# Altium schematic sheet printer_control.SchDoc
size A2; DocumentNumber: 8; Revision: V1.0; SheetNumber: 8; SheetTotal: 9
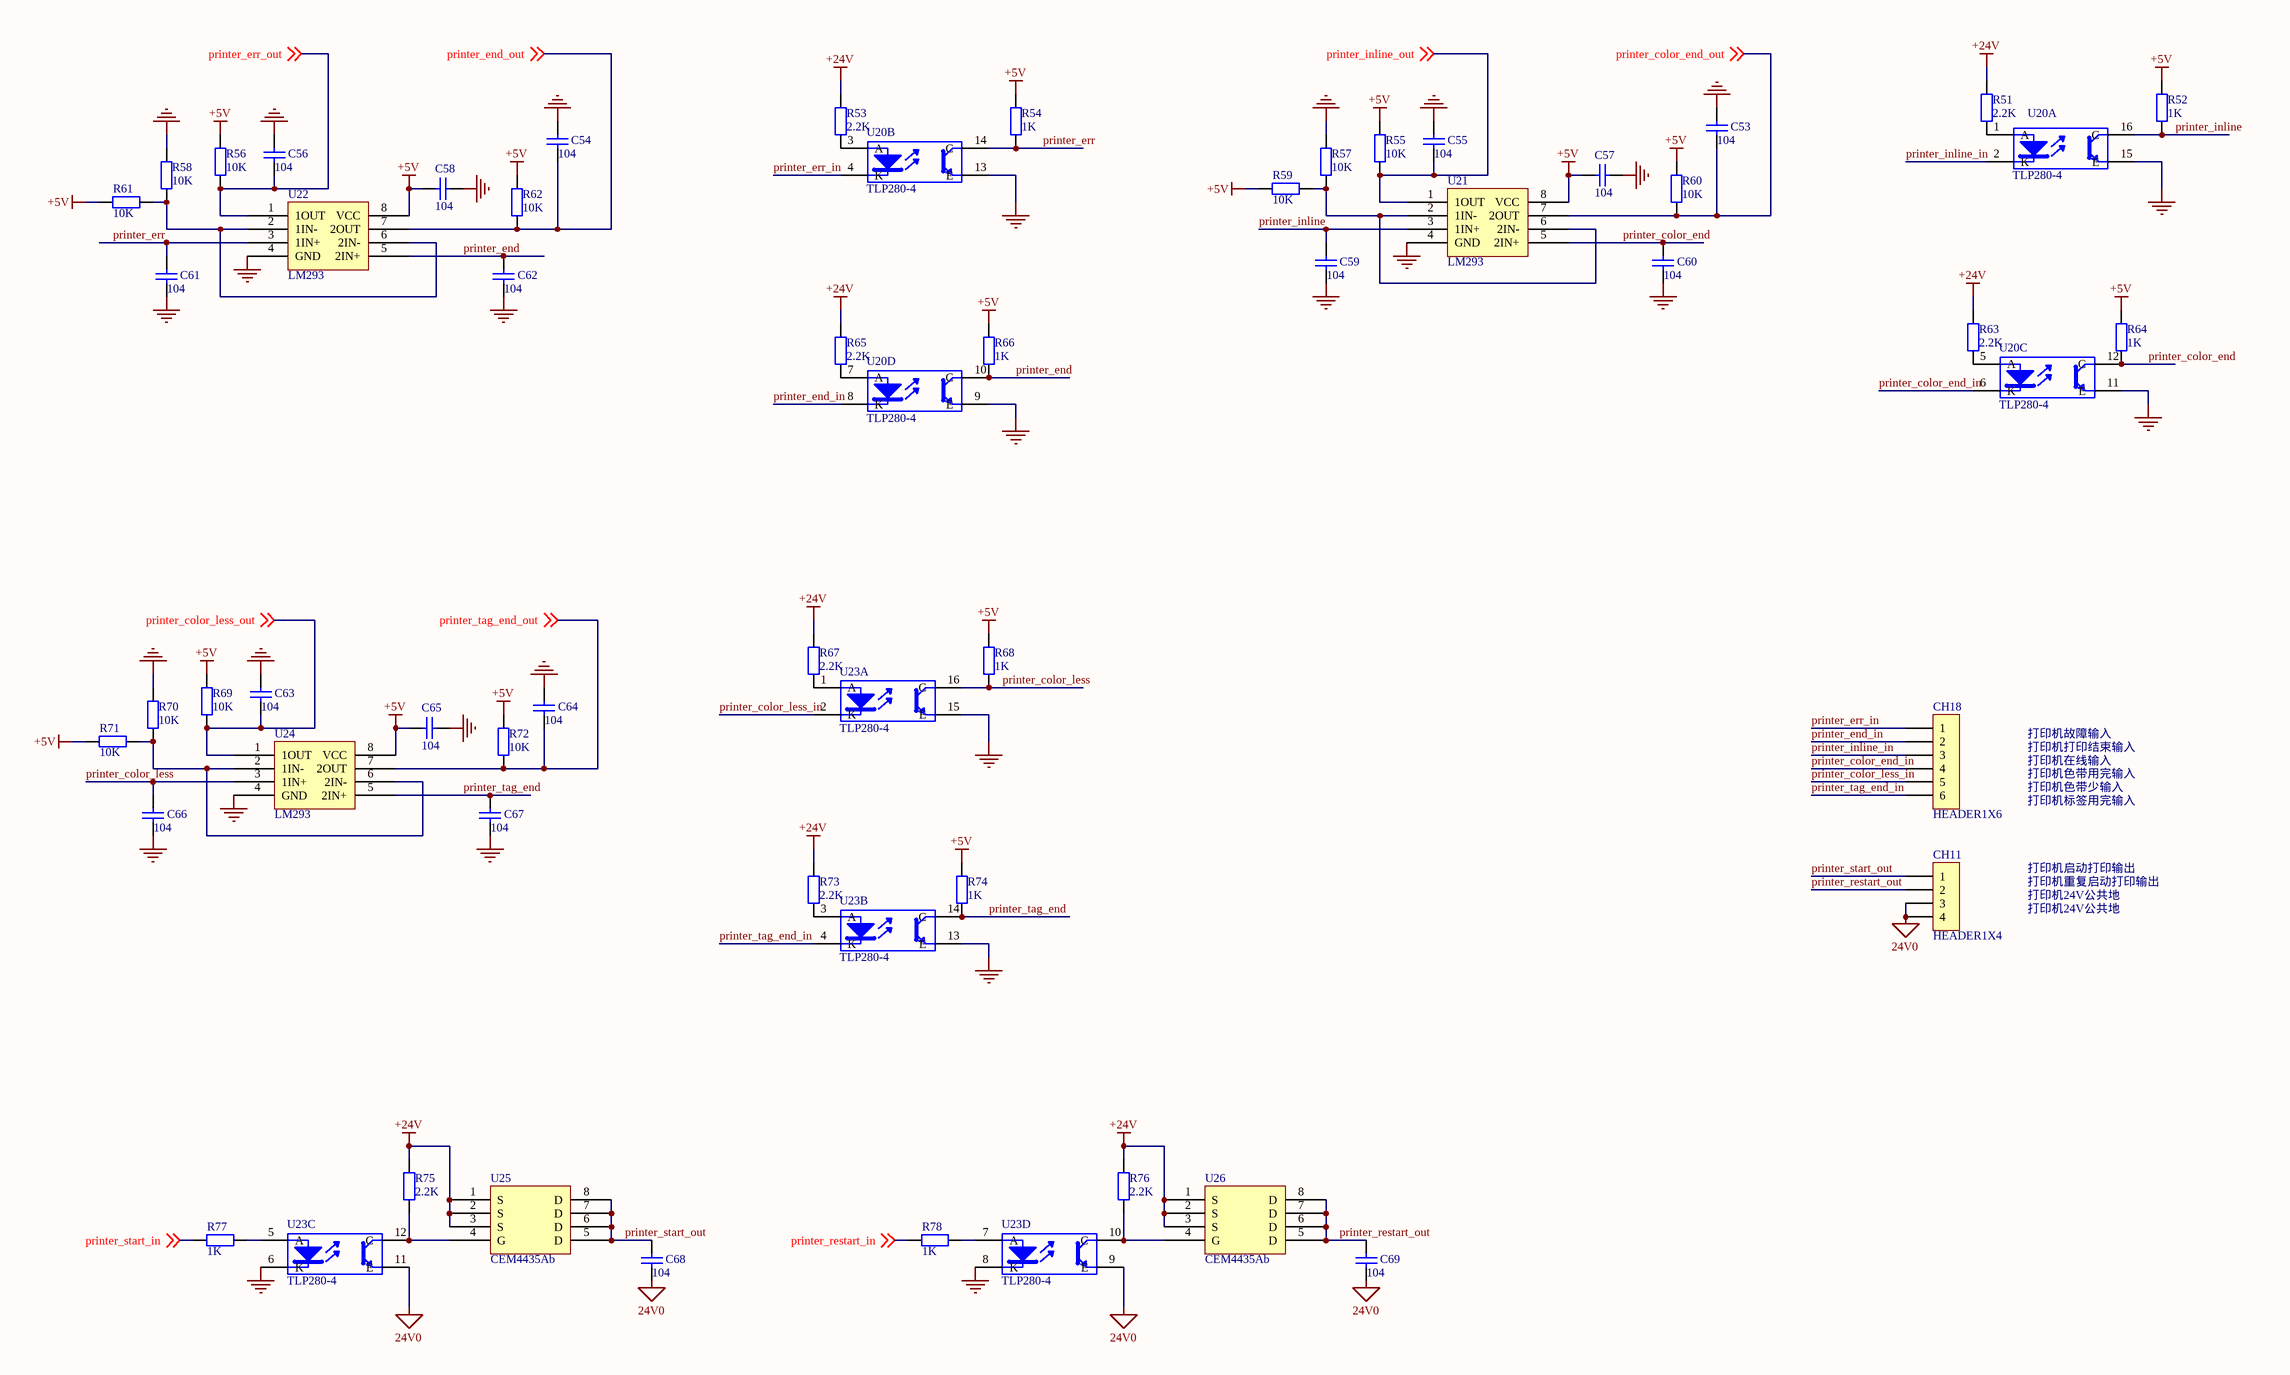
[diagram p0: printer_control.SchDoc]

## Parts
C53  value 104  [0805]  (hidden comment: Cap)
C54  value 104  [0805]  (hidden comment: Cap)
C55  value 104  [0805]  (hidden comment: Cap)
C56  value 104  [0805]  (hidden comment: Cap)
C57  value 104  [0805]  (hidden comment: Cap)
C58  value 104  [0805]  (hidden comment: Cap)
C59  value 104  [0805]  (hidden comment: Cap)
C60  value 104  [0805]  (hidden comment: Cap)
C61  value 104  [0805]  (hidden comment: Cap)
C62  value 104  [0805]  (hidden comment: Cap)
C63  value 104  [0805]  (hidden comment: Cap)
C64  value 104  [0805]  (hidden comment: Cap)
C65  value 104  [0805]  (hidden comment: Cap)
C66  value 104  [0805]  (hidden comment: Cap)
C67  value 104  [0805]  (hidden comment: Cap)
C68  value 104  [0805]  (hidden comment: Capb)
C69  value 104  [0805]  (hidden comment: Capb)
CH11  HEADER1X4  [CH3.96-4PIN]
CH18  HEADER1X6  [CH3.96-6PIN]
R51  value 2.2K  [0805]  (hidden comment: Res2)
R52  value 1K  [0805]  (hidden comment: Res2)
R53  value 2.2K  [0805]  (hidden comment: Res2)
R54  value 1K  [0805]  (hidden comment: Res2)
R55  value 10K  [0805]  (hidden comment: Res2)
R56  value 10K  [0805]  (hidden comment: Res2)
R57  value 10K  [0805]  (hidden comment: Res2)
R58  value 10K  [0805]  (hidden comment: Res2)
R59  value 10K  [0805]  (hidden comment: Res2)
R60  value 10K  [0805]  (hidden comment: Res2)
R61  value 10K  [0805]  (hidden comment: Res2)
R62  value 10K  [0805]  (hidden comment: Res2)
R63  value 2.2K  [0805]  (hidden comment: Res2)
R64  value 1K  [0805]  (hidden comment: Res2)
R65  value 2.2K  [0805]  (hidden comment: Res2)
R66  value 1K  [0805]  (hidden comment: Res2)
R67  value 2.2K  [0805]  (hidden comment: Res2)
R68  value 1K  [0805]  (hidden comment: Res2)
R69  value 10K  [0805]  (hidden comment: Res2)
R70  value 10K  [0805]  (hidden comment: Res2)
R71  value 10K  [0805]  (hidden comment: Res2)
R72  value 10K  [0805]  (hidden comment: Res2)
R73  value 2.2K  [0805]  (hidden comment: Res2)
R74  value 1K  [0805]  (hidden comment: Res2)
R75  value 2.2K  [0805]  (hidden comment: Res2)
R76  value 2.2K  [0805]  (hidden comment: Res2)
R77  value 1K  [0805]  (hidden comment: Res2)
R78  value 1K  [0805]  (hidden comment: Res2)
U20  TLP280-4  [SO16]  (parts A,B,C,D of 4)
U21  LM293  [SOP8-OP27]
U22  LM293  [SOP8-OP27]
U23  TLP280-4  [SO16]  (parts A,B,C,D of 4)
U24  LM293  [SOP8-OP27]
U25  CEM4435Ab  [SOP8-OP27]
U26  CEM4435Ab  [SOP8-OP27]

## Nets
24V0: C68.1 C69.1 CH11.3 CH11.4 U23.9(E) U23.11(E)
+5V: C57.2 C58.2 C65.2 R52.1 R54.1 R55.1 R56.1 R59.1 R60.1 R61.1 R62.1 R64.1 R66.1 R68.1 R69.1 R71.1 R72.1 R74.1 U21.8(VCC) U22.8(VCC) U24.8(VCC)
+24V: R51.1 R53.1 R63.1 R65.1 R67.1 R73.1 R75.1 R76.1 U25.1(S) U25.2(S) U25.3(S) U26.1(S) U26.2(S) U26.3(S)
GND: C53.2 C54.2 C55.2 C56.2 C57.1 C58.1 C59.1 C60.1 C61.1 C62.1 C63.2 C64.2 C65.1 C66.1 C67.1 R57.1 R58.1 R70.1 U20.9(E) U20.11(E) U20.13(E) U20.15(E) U21.4(GND) U22.4(GND) U23.6(K) U23.8(K) U23.13(E) U23.15(E) U24.4(GND)
printer_color_end: C60.2 R64.2 U20.12(C) U21.5(2IN+)
printer_color_end_in: CH18.4 U20.6(K)
printer_color_end_out: C53.1 R60.2 U21.7(2OUT) ; off-sheet printer_color_end_out
printer_color_less: C66.2 R68.2 U23.16(C) U24.3(1IN+)
printer_color_less_in: CH18.5 U23.2(K)
printer_color_less_out: C63.1 R69.2 U24.1(1OUT) ; off-sheet printer_color_less_out
printer_end: C62.2 R66.2 U20.10(C) U22.5(2IN+)
printer_end_in: CH18.2 U20.8(K)
printer_end_out: C54.1 R62.2 U22.7(2OUT) ; off-sheet printer_end_out
printer_err: C61.2 R54.2 U20.14(C) U22.3(1IN+)
printer_err_in: CH18.1 U20.4(K)
printer_err_out: C56.1 R56.2 U22.1(1OUT) ; off-sheet printer_err_out
printer_inline: C59.2 R52.2 U20.16(C) U21.3(1IN+)
printer_inline_in: CH18.3 U20.2(K)
printer_inline_out: C55.1 R55.2 U21.1(1OUT) ; off-sheet printer_inline_out
printer_restart_in: R78.1 ; off-sheet printer_restart_in
printer_restart_out: C69.2 CH11.2 U26.5(D) U26.6(D) U26.7(D) U26.8(D)
printer_start_in: R77.1 ; off-sheet printer_start_in
printer_start_out: C68.2 CH11.1 U25.5(D) U25.6(D) U25.7(D) U25.8(D)
printer_tag_end: C67.2 R74.2 U23.14(C) U24.5(2IN+)
printer_tag_end_in: CH18.6 U23.4(K)
printer_tag_end_out: C64.1 R72.2 U24.7(2OUT) ; off-sheet printer_tag_end_out
NetR51_2: R51.2 U20.1(A)
NetR53_2: R53.2 U20.3(A)
NetR57_2: R57.2 R59.2 U21.2(1IN-) U21.6(2IN-)
NetR58_2: R58.2 R61.2 U22.2(1IN-) U22.6(2IN-)
NetR63_2: R63.2 U20.5(A)
NetR65_2: R65.2 U20.7(A)
NetR67_2: R67.2 U23.1(A)
NetR70_2: R70.2 R71.2 U24.2(1IN-) U24.6(2IN-)
NetR73_2: R73.2 U23.3(A)
NetR75_2: R75.2 U23.12(C) U25.4(G)
NetR76_2: R76.2 U23.10(C) U26.4(G)
NetR77_2: R77.2 U23.5(A)
NetR78_2: R78.2 U23.7(A)

## Notes on the sheet
- 打印机故障输入
- 打印机打印结束输入
- 打印机在线输入
- 打印机色带用完输入
- 打印机色带少输入
- 打印机标签用完输入
- 打印机启动打印输出
- 打印机重复启动打印输出
- 打印机24V公共地
- :

## Library data of the parts
C53-C69 = Cap: Capacitor; Published: 8-Jun-2000; LatestRevisionDate: 17-Jul-2002; LatestRevisionNote: Re-released for DXP Platform.; PackageReference: RAD-0.3; Publisher: Altium Limited
R51-R78 = Res2: Resistor; Published: 8-Jun-2000; LatestRevisionDate: 17-Jul-2002; LatestRevisionNote: Re-released for DXP Platform.; PackageReference: AXIAL-0.4; Publisher: Altium Limited
U20 U23 = TLP521-4
U25 U26 = CEM4435A